# Altium schematic sheet Sensor_MQ-135.SchDoc
size A4; SheetNumber: 3; SheetTotal: 3
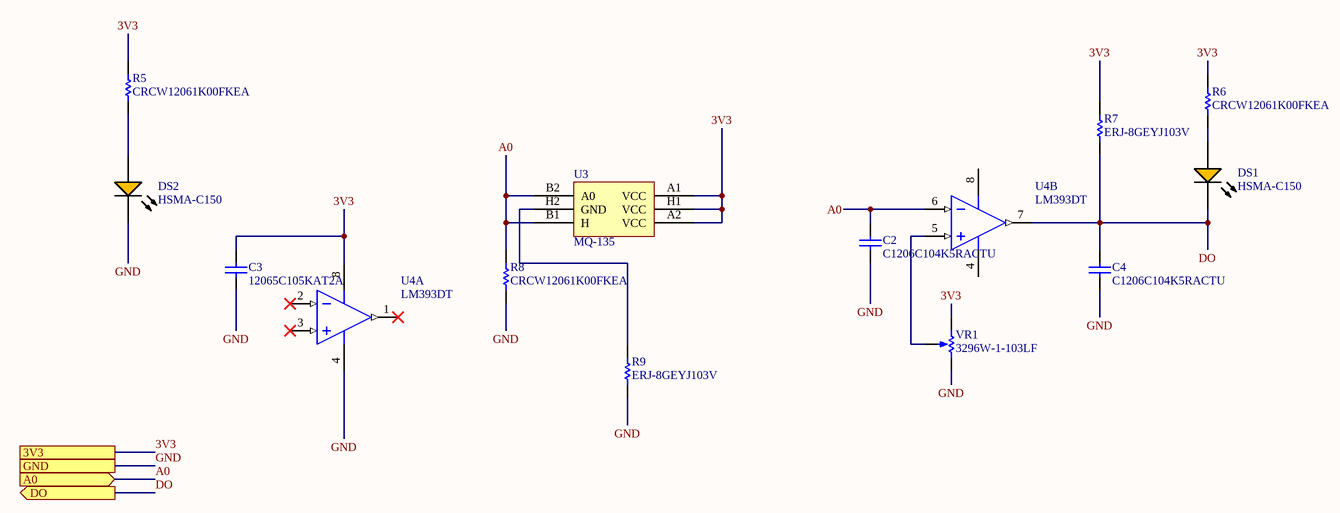
[diagram p0: Sensor_MQ-135.SchDoc]

## Parts
C2  C1206C104K5RACTU  [KEMT-1206-2_M]
C3  12065C105KAT2A  [CAPC3216X180X50LL20T25]
C4  C1206C104K5RACTU  [KEMT-1206-2_M]
DS1  HSMA-C150  [AVAG-HSMX-C150_V]
DS2  HSMA-C150  [AVAG-HSMX-C150_V]
R5  CRCW12061K00FKEA  [RESC3216X60X45ML15T20]
R6  CRCW12061K00FKEA  [RESC3216X60X45ML15T20]
R7  ERJ-8GEYJ103V  [RESC3216X70X50NL05T20]
R8  CRCW12061K00FKEA  [RESC3216X60X45ML15T20]
R9  ERJ-8GEYJ103V  [RESC3216X70X50NL05T20]
U3  MQ-135  [PCBComponent_1]
U4  LM393DT  [STM-SO-8_D_L]  (parts A,B of 2)
VR1  3296W-1-103LF  [BOUR-3296W]

## Ports
3V3, A0 (in), DO (out), GND

## Nets
3V3: C3.2 R5.2 R6.2 R7.2 U3.A1(VCC) U3.A2(VCC) U3.H1(VCC) U4.8(VCC+) VR1.1(CCW) ; port 3V3
A0: C2.2 R8.2 U3.B1(H) U3.B2(A0) U4.6(IN2-) ; port A0
DO: C4.2 DS1.2(K) R7.1 U4.7(OUT2) ; port DO
GND: C2.1 C3.1 C4.1 DS2.2(K) R8.1 R9.1 U4.4(VCC-) VR1.3(CW) ; port GND
NetDS1_1: DS1.1(A) R6.1
NetDS2_1: DS2.1(A) R5.1
NetR9_2: R9.2 U3.H2(GND)
NetU4_5: U4.5(IN2+) VR1.2(S)

Not connected (* = marked no-connect by the designer): U4 1(OUT1)* 2(IN1-)* 3(IN1+)*

## Library data of the parts
C2 C4 = CMP-1037-04202-2: CAP, Ceramic, 0.1 uF, +/- 10%, 50 V, -55 to 125 degC, 1206 (3216 Metric), RoHS, Tape and Reel; Manufacturer: Kemet; Voltage Rating: 50V; Capacitance: 0.1µF; Product Range: KEMET-CSeries; SVHC: ToBeAdvised; Dielectric Characteristic: X7R; Capacitor Case Style: 1206[3216Metric]; Package Reference: 1206-2; Package Description: 2-Leads SMD, Body 3.2 x 1.6 mm; Packaging: Tape&Reel; Operating Temperature Max: 125degC; Capacitance Tolerance: ±10%; Datasheet URL: https://datasheet.ciiva.com/6125/1725438-6125494.pdf; Manufacturer URL: http://www.kemet.com/; Operating Temperature Min: -55degC; Datasheet Version: Jul-13
C3 = CMP-2000-05866-1: Chip Capacitor, 1 uF, +/- 10%, 50 V, -55 to 125 degC, 1206 (3216 Metric), RoHS, Tape and Reel; Manufacturer: AVX; Capacitance: 1µF; Dielectric: X7R; Rated Voltage: 50V; Datasheet URL: http://datasheets.avx.com/X7RDielectric.pdf; Package Reference: 1206; Tolerance (%): ±10%; Mounting Technology: SurfaceMount; Case Size/Dimension: 1206; Package Description: 2-Pin Surface Mount Device, Body 3.2 x 1.6 mm; Datasheet Version: 07/2016; Manufacturer URL: http://www.avx.com/
DS1 DS2 = CMP-2000-06420-1: High Performance Chip LED, 60 mW, 25 mA, -30 to 85 degC, 2-Pin SMD, RoHS, Tape and Reel; Manufacturer: AvagoTechnologies; Wavelength/Color Temperature: 592nm; Luminous Intensity: 90mcd; Illumination Color: Amber; Power Rating: 60mW; Forward Current: 20mA; LED Size: 3.2mmx1.6mmx1.1mm; Lens Color/Style: Diffused; Viewing Angle: 170deg; Forward Voltage: 1.9V; Factory Pack Quantity: 3000; RoHS: Details; Datasheet URL: https://datasheet.ciiva.com/29280/180503-da-01-en-chip-led-hsma-c150-gelb-29280992.pdf; Package / Case: 3.2mmx1.6mmx1.1mm; Packaging: Reel; Maximum Operating Temperature: +85C; Mounting Technology: SurfaceMount; Package Description: 2-Pin Surface Mount Device, Body 3.2 x 1.6 mm; Brand: AvagoTechnologies; Product Category: StandardLEDs-SMD; Package Reference: HSMX-C150; Manufacturer URL: http://www.avagotech.com/; Minimum Operating Temperature: -40C; Datasheet Version: 03/2008
R5 R6 R8 = CMP-2100-03616-1: Chip Resistor, 1 KOhm, +/- 1%, 0.25 W, -55 to 155 degC, 1206 (3216 Metric), RoHS, Tape and Reel; Manufacturer: Vishay Semiconductor; Power Rating: 250mW; Voltage Rating (DC): 200V; Resistance: 1KOhm; Temperature Coefficient: 100ppm/degreesC; Case Code (Imperial): 1206; Length: 3.2mm; Case/Package: 1206; Contact Plating: Tin; Package Quantity: 10; Datasheet URL: http://www.farnell.com/datasheets/1720486.pdf; Mount: SurfaceMount; Package Description: 2-Pin Surface Mount Device, Body 3.15 x 1.6 mm; Package Reference: 1206.0; Max Operating Temperature: 155degC; Lead Free: LeadFree; Weight: 0.000353oz; Military Standard: Not; Max Power Dissipation: 250mW; Case Code (Metric): 3216; Number of Terminations: 2; Tolerance: 1%; Width: 0.063inch; Termination: SMD/SMT; Number of Pins: 2; Min Operating Temperature: -55degC; Height: 0.55mm; Depth: 1.6mm; RoHSCompliant: true; Composition: ThickFilm; Packaging: TapeandReel; Manufacturer URL: http://www.vishay.com/; Voltage Rating: 200V; Radiation Hardening: No; REACH SVHC: Unknown; Datasheet Version: 41061.0
R7 R9 = CMP-2003-00545-1: Manufacturer: Panasonic; Part Number: ERJ-8GEYJ103V
U4 = CMP-2000-06550-1: Low-Power, Dual-Voltage Comparator, 2 to 36 V, 0 to 70 degC, 8-Pin SOIC (SO), RoHS, Tape and Reel; Manufacturer: STMicroelectronics; Voltage - Supply, Single/Dual (±): 2V~36V,±1V~18V; Current - Input Bias (Max): 0.25µA@5V; Number of Elements: 2; Current - Output (Typ): 18mA@5V; Other Names: 497-1593-2; Voltage - Input Offset (Max): 5mV@30V; Output Type: CMOS,DTL,ECL,MOS,Open-Collector,TTL; EDA / CAD Models: DownloadfromAcceleratedDesigns; Other Related Documents: LM393ViewAllSpecificationsLM393ViewAllSpecifications; Online Catalog: Comparators-2elements; Current - Quiescent (Max): 2.5mA; Standard Package: 2,500; Manufacturer URL: http://www.st.com/; Package Description: 8-Pin Small Outline Integrated Circuit, Body 4.9 x 3.9 mm, Pitch 1.27 mm; Packaging: Tape&Reel(TR); Datasheet Version: Rev. 15, 02/2016; Category: IntegratedCircuits(ICs); Operating Temperature: 0°C~70°C; Mounting Type: SurfaceMount; Supplier Device Package: 8-SO; Datasheet URL: http://www.st.com/content/ccc/resource/technical/document/datasheet/group1/b4/cc/cf/13/18/28/44/f5/CD00000465/files/CD00000465.pdf/jcr:content/translations/en.CD00000465.pdf; Family: Linear-Comparators; Mounting Technology: SurfaceMount; Type: GeneralPurpose; Package Reference: SO-8; Package / Case: 8-SOIC(0.154",3.90mmWidth)
VR1 = CMP-1747-00001-1: Square Trimpot(R) Trimming Potentiometer, 10 KOhm, +/- 10%, 0.5 W, -55 to 125 degC, 3-Pin THD, RoHS, Tube; Voltage Rating: 75 V; Resistance: 120 Ohm; Tolerance: 1%; Power Rating: 100 mW; Case\Package: 0603; Type (Resistor): Thick Film; PackageDescription: 3-Pin Through Hole Device, Body 9.53 x 4.83 mm, Pitch 2.54 mm; RoHSCompliant: true; Package Quantity: 5000; Case Code (Metric): 1608; PackageReference: 3296W; ComponentLink2Description: Datasheet; REACH SVHC: Unknown; Case Code (Imperial): 0603; ComponentLink1URL: http://www.bourns.com/; Width: 0.85 mm; Radiation Hardening: No; Min Operating Temperature: -55 degC; Mount: Surface Mount; ComponentLink1Description: Manufacturer URL; Max Operating Temperature: 155 degC; Weight: 7.1E-05 oz; Pins: 2; DatasheetVersion: May-16; Packaging: Tape and Reel; Height: 0.45 mm; Length: 1.55 mm; ComponentLink2URL: http://www.bourns.com/docs/Product-Datasheets/3296.pdf